# EAGLE design puppetboard (EAGLE 9.6.2)
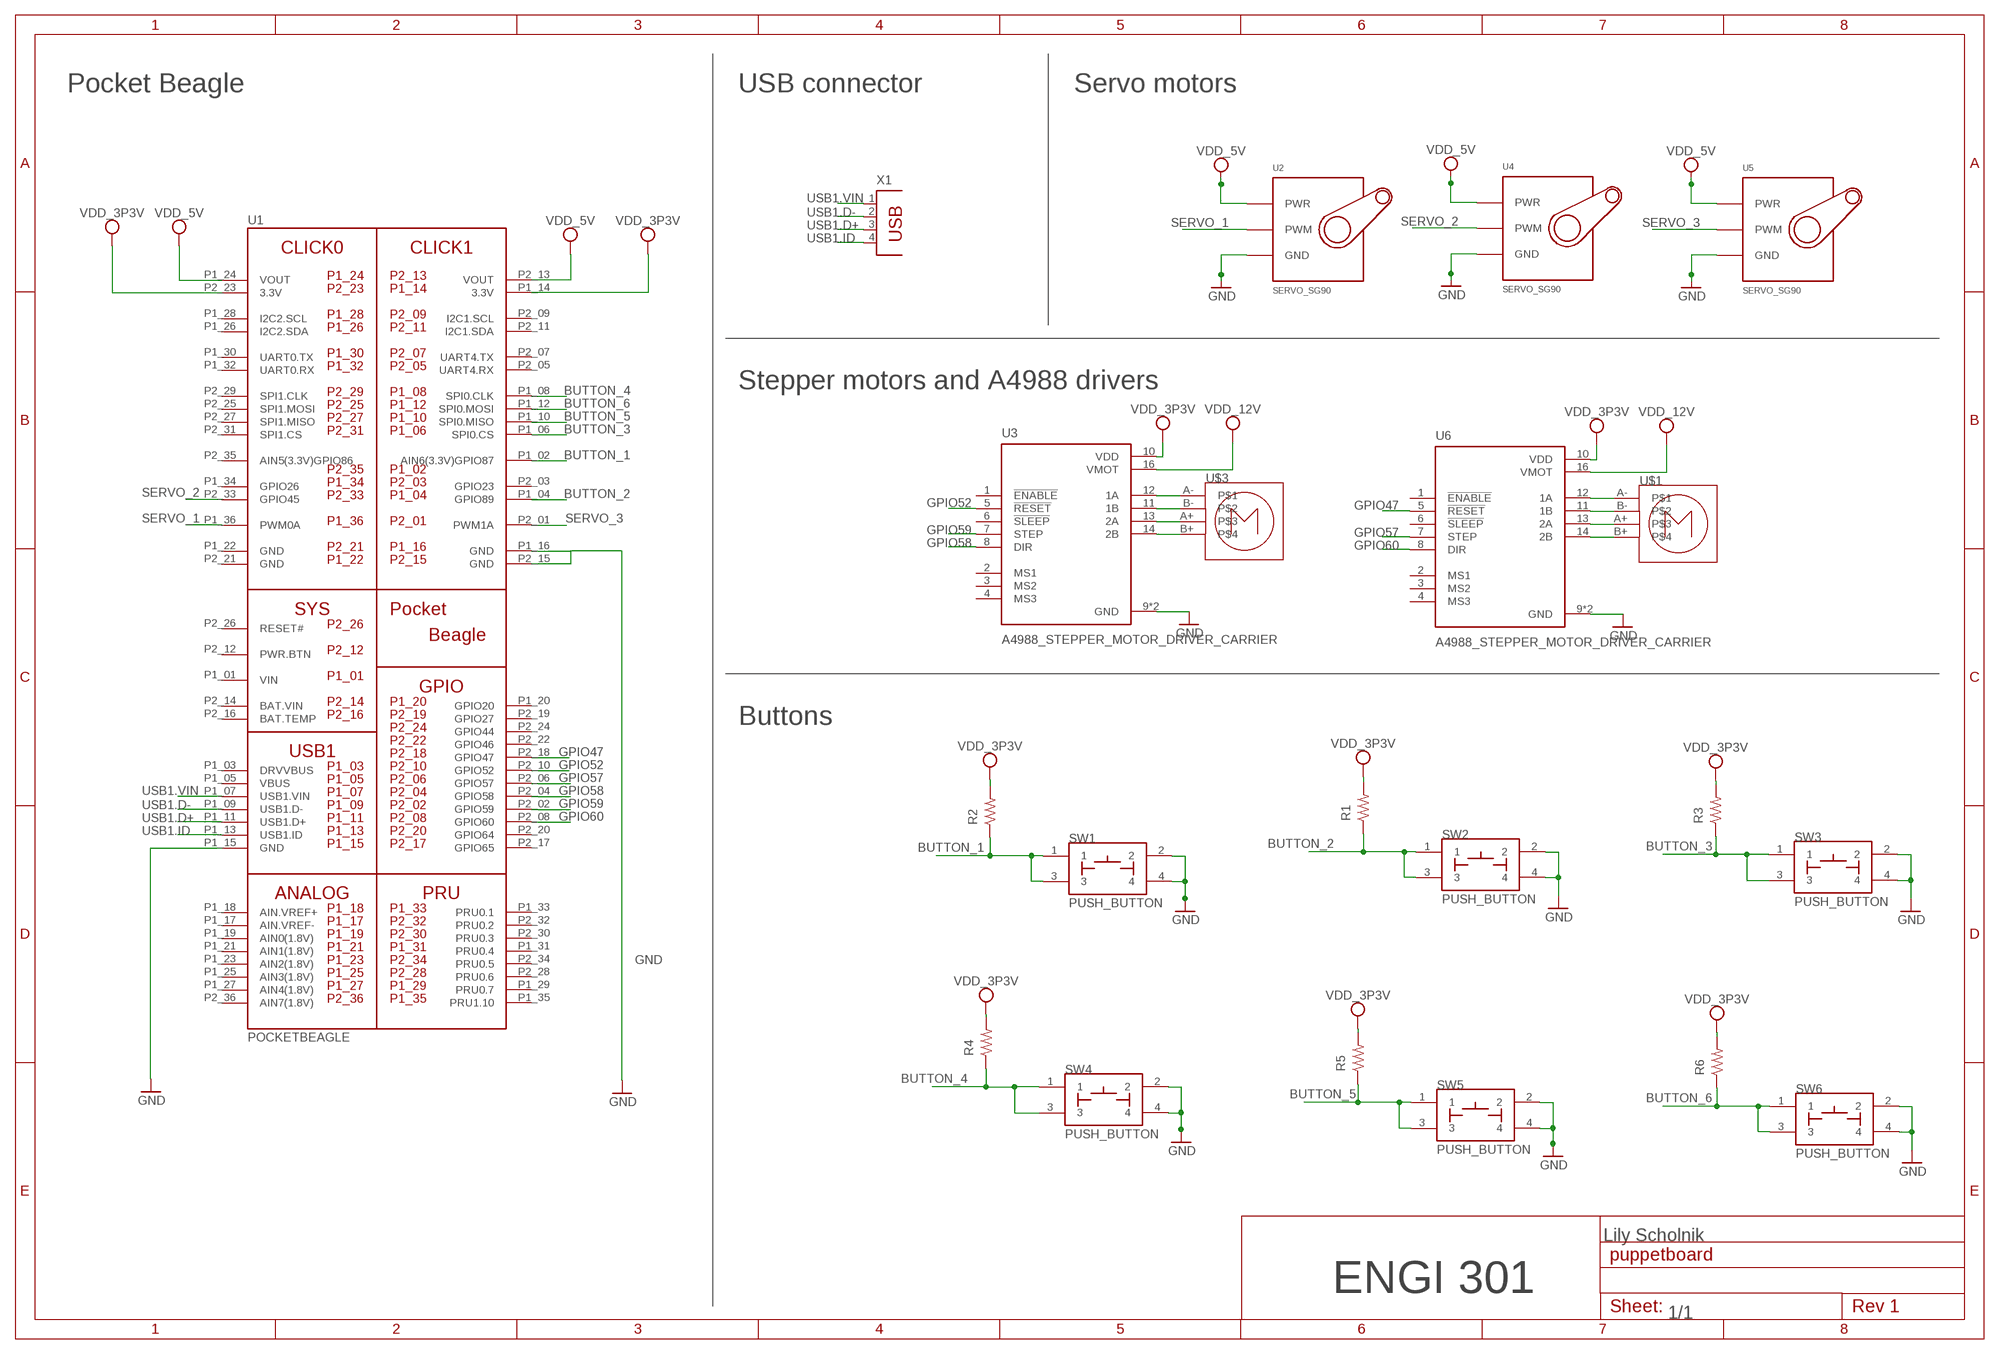
[diagram p0: schematic, sheet 1]

## Parts
R1  R_R0603  [R0603]
R2  R_R0603  [R0603]
R3  R_R0603  [R0603]
R4  R_R0603  [R0603]
R5  R_R0603  [R0603]
R6  R_R0603  [R0603]
SW1  PUSH_BUTTON  [BUTTON_12.5MM]
SW2  PUSH_BUTTON  [BUTTON_12.5MM]
SW3  PUSH_BUTTON  [BUTTON_12.5MM]
SW4  PUSH_BUTTON  [BUTTON_12.5MM]
SW5  PUSH_BUTTON  [BUTTON_12.5MM]
SW6  PUSH_BUTTON  [BUTTON_12.5MM]
U1  POCKETBEAGLE  [POCKETBEAGLE]
U2  SERVO_SG90  [SERVO-X1]
U3  A4988_STEPPER_MOTOR_DRIVER_CARRIER  [MODULE_A4988_STEPPER_MOTOR_DRIVER_CARRIER]
U4  SERVO_SG90  [SERVO-X1]
U5  SERVO_SG90  [SERVO-X1]
U6  A4988_STEPPER_MOTOR_DRIVER_CARRIER  [MODULE_A4988_STEPPER_MOTOR_DRIVER_CARRIER]
U$1  STEPPER_MOTOR  [STEPPER_MOTOR]
U$3  STEPPER_MOTOR  [STEPPER_MOTOR]
X1  PN61729  [PN61729]

## Nets
BUTTON_1: R2.1 SW1.1 SW1.3 U1.P1_02(AIN6(3.3V)GPIO87)
BUTTON_2: R1.1 SW2.1 SW2.3 U1.P1_04(GPIO89)
BUTTON_3: R3.1 SW3.1 SW3.3 U1.P1_06(SPI0.CS)
BUTTON_4: R4.1 SW4.1 SW4.3 U1.P1_08(SPI0.CLK)
BUTTON_5: R5.1 SW5.1 SW5.3 U1.P1_10(SPI0.MISO)
BUTTON_6: R6.1 SW6.1 SW6.3 U1.P1_12(SPI0.MOSI)
GND: SW1.2 SW1.4 SW2.2 SW2.4 SW3.2 SW3.4 SW4.2 SW4.4 SW5.2 SW5.4 SW6.2 SW6.4 U1.P1_15(GND) U1.P1_16(GND) U1.P2_15(GND) U2.GND U3.9(GND) U3.15(GND) U4.GND U5.GND U6.9(GND) U6.15(GND)
GPIO47: U1.P2_18(GPIO47) U6.5(!RESET)
GPIO52: U1.P2_10(GPIO52) U3.5(!RESET)
GPIO57: U1.P2_06(GPIO57) U6.7(STEP)
GPIO58: U1.P2_04(GPIO58) U3.8(DIR)
GPIO59: U1.P2_02(GPIO59) U3.7(STEP)
GPIO60: U1.P2_08(GPIO60) U6.8(DIR)
N$8: U6.12(1A) U$1.A-
N$9: U6.11(1B) U$1.B-
N$10: U6.13(2A) U$1.A+
N$11: U6.14(2B) U$1.B+
N$21: U3.12(1A) U$3.A-
N$22: U3.11(1B) U$3.B-
N$23: U3.13(2A) U$3.A+
N$24: U3.14(2B) U$3.B+
SERVO_1: U1.P1_36(PWM0A) U2.SIG(PWM)
SERVO_2: U1.P2_33(GPIO45) U4.SIG(PWM)
SERVO_3: U1.P2_01(PWM1A) U5.SIG(PWM)
USB1.D+: U1.P1_11(USB1.D+) X1.3
USB1.D-: U1.P1_09(USB1.D-) X1.2
USB1.ID: U1.P1_13(USB1.ID) X1.4
USB1.VIN: U1.P1_07(USB1.VIN) X1.1
VDD_3P3V: R1.2 R2.2 R3.2 R4.2 R5.2 R6.2 U1.P1_14(3.3V) U1.P2_23(3.3V) U3.10(VDD) U6.10(VDD)
VDD_5V: U1.P1_24(VOUT) U1.P2_13(VOUT) U2.PWR U3.16(VMOT) U4.PWR U5.PWR U6.16(VMOT) ; supply symbol labelled VDD_12V
Unconnected: U1.P1_03(DRVVBUS) U1.P1_05(VBUS) U1.P1_17(AIN.VREF-) U1.P1_18(AIN.VREF+) U1.P1_19(AIN0(1.8V)) U1.P1_20(GPIO20) U1.P1_21(AIN1(1.8V)) U1.P1_23(AIN2(1.8V)) U1.P1_25(AIN3(1.8V)) U1.P1_26(I2C2.SDA) U1.P1_27(AIN4(1.8V)) U1.P1_28(I2C2.SCL) U1.P1_29(PRU0.7) U1.P1_30(UART0.TX) U1.P1_31(PRU0.4) U1.P1_32(UART0.RX) U1.P1_33(PRU0.1) U1.P1_34(GPIO26) U1.P1_35(PRU1.10) U1.P2_03(GPIO23) U1.P2_05(UART4.RX) U1.P2_07(UART4.TX) U1.P2_09(I2C1.SCL) U1.P2_11(I2C1.SDA) U1.P2_12(PWR.BTN) U1.P2_16(BAT.TEMP) U1.P2_17(GPIO65) U1.P2_19(GPIO27) U1.P2_20(GPIO64) U1.P2_22(GPIO46) U1.P2_24(GPIO44) U1.P2_25(SPI1.MOSI) U1.P2_26(RESET#) U1.P2_27(SPI1.MISO) U1.P2_28(PRU0.6) U1.P2_29(SPI1.CLK) U1.P2_30(PRU0.3) U1.P2_31(SPI1.CS) U1.P2_32(PRU0.2) U1.P2_34(PRU0.5) U1.P2_35(AIN5(3.3V)GPIO86) U1.P2_36(AIN7(1.8V)) U3.1(!ENABLE) U3.2(MS1) U3.3(MS2) U3.4(MS3) U3.6(!SLEEP) U6.1(!ENABLE) U6.2(MS1) U6.3(MS2) U6.4(MS3) U6.6(!SLEEP)

## Notes on the sheet
- Pocket Beagle | USB connector | Servo motors
- Stepper motors and A4988 drivers
- Buttons
- Lily Scholnik
- ENGI 301
- 1/1

## Power pins joined to a net without a drawn wire
BAT.VIN: U1.P2_14(BAT.VIN)
GND: U1.P1_22(GND) U1.P2_21(GND)
VIN: U1.P1_01(VIN)

## Library data of the parts
R1-R6 = combolock:R_: RESISTOR, American symbol
SW1-SW6 = combolock:PUSH_BUTTON
U1 = combolock:POCKETBEAGLE
U2 U4 U5 = combolock:SERVO_SG90
U3 U6 = A4988_STEPPER_MOTOR_DRIVER_CARRIER:A4988_STEPPER_MOTOR_DRIVER_CARRIER: Stepper motor controler; IC: A4988; 1A; Uin mot: 8÷35V Check availability <https://pricing.snapeda.com/parts/A4988%20STEPPER%20MOTOR%20DRIVER%20CARRIER/Pololu/view-part?ref=eda>; AVAILABILITY: Not in stock; DESCRIPTION: Stepper Motor Driver; MF: Pololu; MP: A4988 STEPPER MOTOR DRIVER CARRIER; PACKAGE: None; PRICE: None
U$1 U$3 = shadowpuppets:STEPPER_MOTOR
X1 = con-berg:PN61729: BERG USB connector; OC_FARNELL: unknown; OC_NEWARK: unknown

## Board
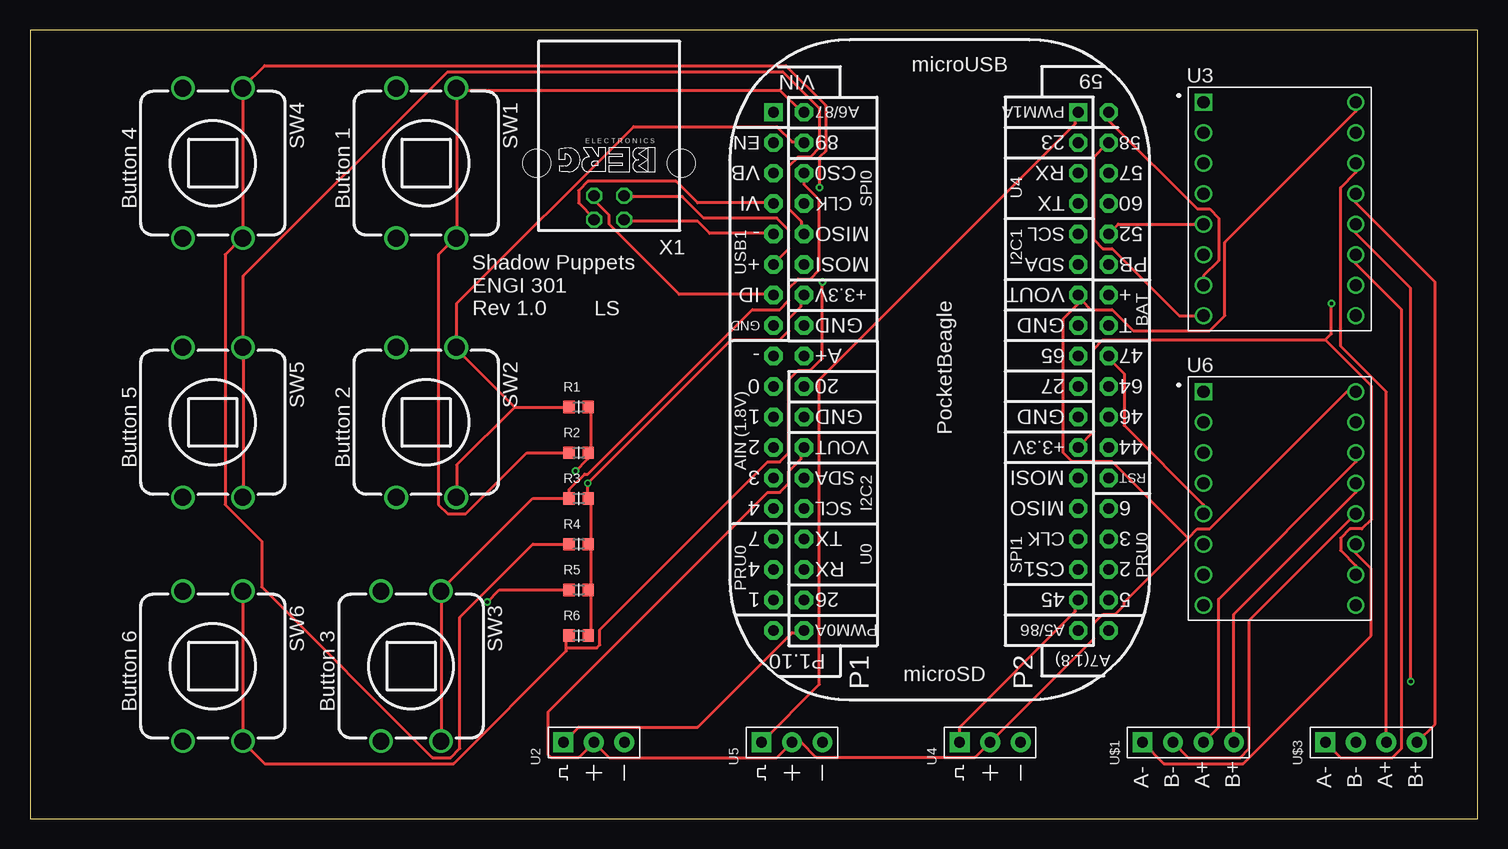
[diagram p1: board, top side]
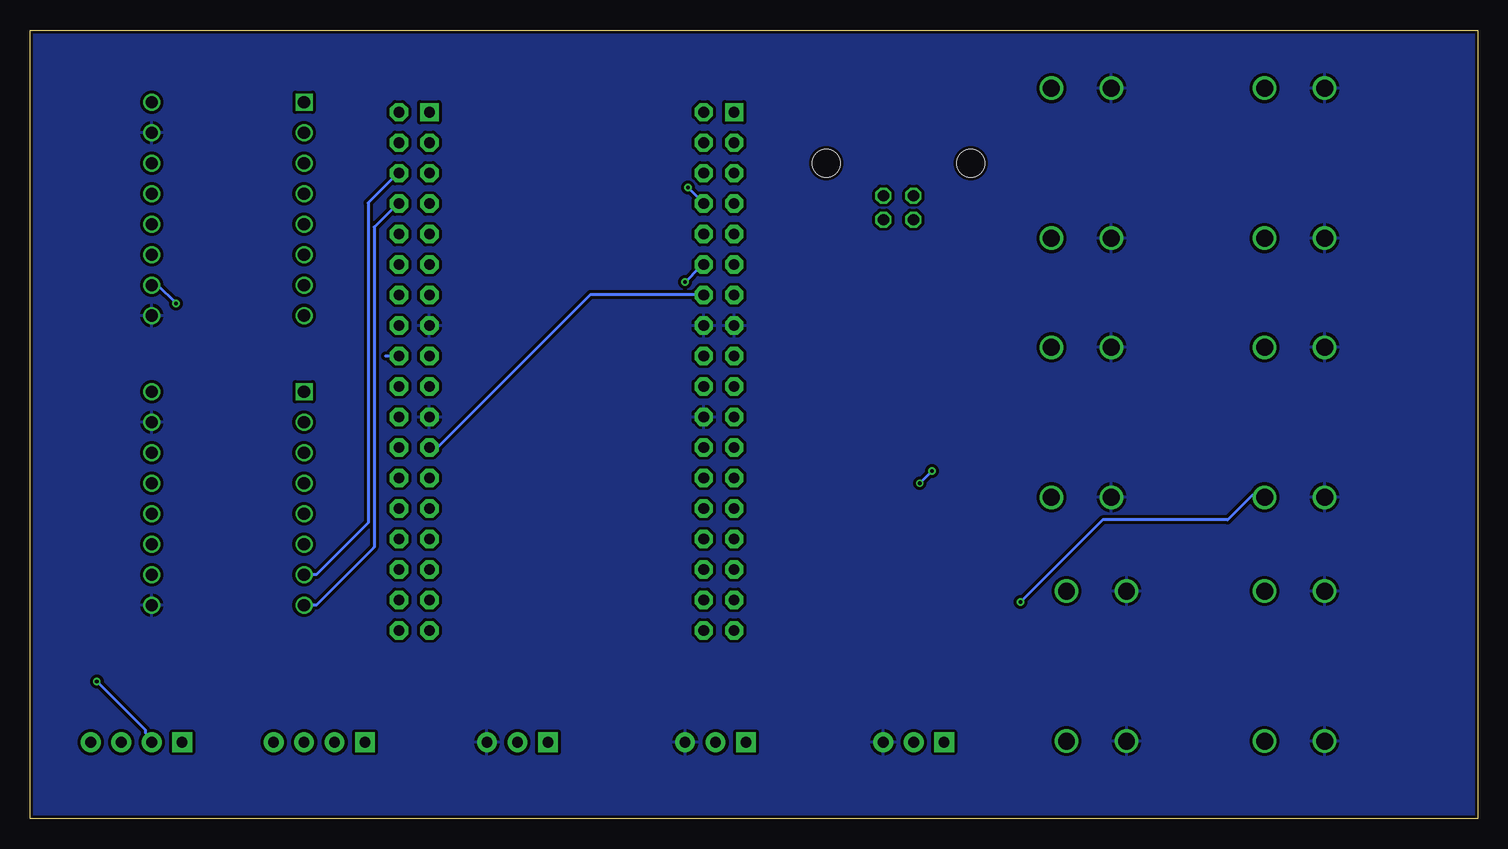
[diagram p2: board, bottom side, seen from below]

Size 120.63 x 65.71 mm. Coordinates in mm from the lower left corner, seen from the top.
Outline: 0,0 120.63,0 120.63,65.71 0,65.71 0,0
Copper layers (1*2*15*16): Top 0.035mm / dielectric 0.23mm / Route2 0.035mm / dielectric 0.93mm / Route15 0.035mm / dielectric 0.23mm / Bottom 0.035mm
Design rules "ENGI301_4lyr": minimum track width 10mil, minimum drill 12mil, track to track 10mil, track to pad 10mil, pad to pad 10mil, via to via 10mil, smd to smd 10mil, copper to edge 10mil, drill to drill 12mil, minimum pad ring 6mil, minimum via ring 6mil, stop-mask expansion 3mil, vias tented up to drill 25mil, thermal gap 10mil

### Footprints (pad centres in the part's own frame; a part is rotated, then mirrored left to right if it is on the bottom)
R0603 = smd 0.95 x 1.031: 1 -0.8,0; 2 0.8,0
BUTTON_12.5MM = drill 1.4: 1 -6.25,2.5; 2 -6.25,-2.5; 3 6.25,2.5; 4 6.25,-2.5
POCKETBEAGLE = drill 0.889 pad 1.524 square: P1_01 5.91,3.53; P2_01 5.91,28.93 | drill 0.889 pad 1.524 octagon: P1_02 5.91,6.07; P1_03 8.45,3.53; P1_04 8.45,6.07; P1_05 10.99,3.53; P1_06 10.99,6.07; P1_07 13.53,3.53; P1_08 13.53,6.07; P1_09 16.07,3.53; P1_10 16.07,6.07; P1_11 18.61,3.53; P1_12 18.61,6.07; P1_13 21.15,3.53; P1_14 21.15,6.07; P1_15 23.69,3.53; P1_16 23.69,6.07; P1_17 26.23,3.53; P1_18 26.23,6.07; P1_19 28.77,3.53; P1_20 28.77,6.07; P1_21 31.31,3.53; P1_22 31.31,6.07; P1_23 33.85,3.53; P1_24 33.85,6.07; P1_25 36.39,3.53; P1_26 36.39,6.07; P1_27 38.93,3.53; P1_28 38.93,6.07; P1_29 41.47,3.53; P1_30 41.47,6.07; P1_31 44.01,3.53; P1_32 44.01,6.07; P1_33 46.55,3.53; P1_34 46.55,6.07; P1_35 49.09,3.53; P1_36 49.09,6.07; P2_02 5.91,31.47; P2_03 8.45,28.93; P2_04 8.45,31.47; P2_05 10.99,28.93; P2_06 10.99,31.47; P2_07 13.53,28.93; P2_08 13.53,31.47; P2_09 16.07,28.93; P2_10 16.07,31.47; P2_11 18.61,28.93; P2_12 18.61,31.47; P2_13 21.15,28.93; P2_14 21.15,31.47; P2_15 23.69,28.93; P2_16 23.69,31.47; P2_17 26.23,28.93; P2_18 26.23,31.47; P2_19 28.77,28.93; P2_20 28.77,31.47; P2_21 31.31,28.93; P2_22 31.31,31.47; P2_23 33.85,28.93; P2_24 33.85,31.47; P2_25 36.39,28.93; P2_26 36.39,31.47; P2_27 38.93,28.93; P2_28 38.93,31.47; P2_29 41.47,28.93; P2_30 41.47,31.47; P2_31 44.01,28.93; P2_32 44.01,31.47; P2_33 46.55,28.93; P2_34 46.55,31.47; P2_35 49.09,28.93; P2_36 49.09,31.47
SERVO-X1 = drill 0.889 pad 1.651: GND 0,-2.54; PWR 0,0 | drill 0.889 pad 1.651 square: SIG 0,2.54
MODULE_A4988_STEPPER_MOTOR_DRIVER_CARRIER = drill 1.02 square: 1 -6.35,8.89 | drill 1.02: 2 -6.35,6.35; 3 -6.35,3.81; 4 -6.35,1.27; 5 -6.35,-1.27; 6 -6.35,-3.81; 7 -6.35,-6.35; 8 -6.35,-8.89; 9 6.35,-8.89; 10 6.35,-6.35; 11 6.35,-3.81; 12 6.35,-1.27; 13 6.35,1.27; 14 6.35,3.81; 15 6.35,6.35; 16 6.35,8.89
STEPPER_MOTOR = drill 0.889 pad 1.651: A+ 2.54,-1.27; A- 2.54,3.81; B+ 2.54,1.27 | drill 0.889 pad 1.651 square: B- 2.54,6.35
PN61729 = drill 0.95 octagon: 1 1.25,4.71; 2 -1.25,4.71; 3 -1.25,2.71; 4 1.25,2.71 | hole 2.3: -6.02,0; 6.02,0

### Placement (x,y rotation side)
R1  45.72,34.29 0 top
R2  45.72,30.48 0 top
R3  45.72,26.67 0 top
R4  45.72,22.86 0 top
R5  45.72,19.05 0 top
R6  45.72,15.24 0 top
SW1  33.02,54.61 270 top
SW2  33.02,33.02 270 top
SW3  31.75,12.7 270 top
SW4  15.24,54.61 270 top
SW5  15.24,33.02 270 top
SW6  15.24,12.7 270 top
U1  58.42,64.77 270 top
U2  46.99,6.35 90 top
U3  104.14,50.8 0 top
U4  80.01,6.35 90 top
U5  63.5,6.35 90 top
U6  104.14,26.67 0 top
U$1  99.06,3.81 90 top
U$3  114.3,3.81 90 top
X1  48.26,54.61 180 top

### Tracks (layer width: path | path; a pad name or v marks a point on that pad's centre or on a via)
BUTTON_1
  Top 0.254: R2.1 41.4,30.48 36.32,25.4 34.8,25.4 34.04,26.16 34.04,46.99 35.31,48.26 SW1.3 35.56,48.51 35.56,60.71 | 35.56,60.71 62.48,60.71 64.26,58.93 U1.P1_02 | 35.56,60.71 SW1.1
BUTTON_2
  Top 0.254: SW2.1 35.52,39.58 | 40.39,34.29 R1.1 | 40.39,34.29 35.56,39.12 SW2.1 | U1.P1_04 64.26,56.39 63.5,56.39 62.23,57.66 50.29,57.66 35.56,42.93 35.56,39.62 SW2.1 | 40.39,34.29 35.56,29.46 35.56,26.92 SW2.3
BUTTON_3
  Top 0.254: U1.P1_06 64.52,53.59 64.52,52.83 65.79,51.56 65.79,45.72 65.02,44.96 64.01,44.96 63.25,44.2 63.25,43.18 62.48,42.42 60.2,42.42 46.48,28.7 46.23,28.7 44.96,27.43 44.96,26.67 R3.1 41.91,26.67 34.29,19.05 SW3.1 34.29,18.8 34.29,6.6 SW3.3
BUTTON_4  (via drill 0.3)
  Top 0.254: v65.79,52.58 65.79,55.12 66.29,55.63 66.29,59.44 62.99,62.74 19.56,62.74 17.78,60.96 SW4.1 17.78,60.71 17.78,48.51 SW4.3 17.53,48.26 16.26,46.99 16.26,26.16 19.3,23.11 19.3,19.3 33.53,5.08 35.05,5.08 35.81,5.84 35.81,16.76 41.91,22.86 R4.1
  Bottom 0.254: v65.79,52.58 64.52,51.31 U1.P1_08
BUTTON_5  (via drill 0.3)
  Top 0.254: R5.1 39.12,19.05 v38.1,18.03 | U1.P1_10 64.26,48.77 64.26,49.78 63.25,50.8 63.25,54.36 64.01,55.12 65.02,55.12 65.79,55.88 65.79,59.18 62.74,62.23 34.8,62.23 17.78,45.21 17.78,39.37 SW5.1 17.78,39.12 17.78,26.92 SW5.3
  Bottom 0.254: v38.1,18.03 31.24,24.89 20.83,24.89 18.8,26.92 17.78,26.92 SW5.3
BUTTON_6  (via drill 0.3)
  Top 0.254: 44.7,14.22 44.7,13.97 35.31,4.57 19.56,4.57 17.78,6.35 SW6.3 17.78,6.6 17.78,18.8 SW6.1 | 44.7,14.22 44.7,15.24 R6.1 | v66.04,44.7 66.04,38.35 65.02,37.34 64.01,37.34 63.25,36.58 63.25,30.48 62.48,29.72 61.47,29.72 47.5,15.75 47.5,14.48 47.24,14.22 44.7,14.22
  Bottom 0.254: v66.04,44.7 64.77,45.97 64.52,45.97 U1.P1_12
GND
  Top 0.254: U6.9 111.03,17.78
  pour Bottom: 0,66.04 120.65,66.04 120.65,0 0,0
GPIO47
  Top 0.254: U6.5 97.79,26.16 91.19,32.77 91.19,37.08 89.92,38.35 U1.P2_18
  Bottom 0.254: U1.P2_18 91,38.54
GPIO52
  Top 0.254: U3.5 90.68,49.53 89.92,48.77 U1.P2_10
GPIO57
  Bottom 0.254: U6.7 96.77,20.32 92.46,24.64 92.46,51.31 89.92,53.85 U1.P2_06
GPIO58
  Top 0.254: U3.8 95.76,41.91 90.17,47.5 89.41,47.5 88.65,48.26 88.65,55.12 89.66,56.13 U1.P2_04
GPIO59
  Top 0.254: U3.7 97.79,45.21 99.06,46.48 99.06,50.04 98.3,50.8 97.28,50.8 89.92,58.17 89.92,58.67 U1.P2_02
GPIO60
  Bottom 0.254: U6.8 96.77,17.78 91.95,22.61 91.95,49.28 89.92,51.31 U1.P2_08
N$8
  Top 0.254: U6.12 101.6,16.51 101.6,5.84 100.84,5.08 96.52,5.08 U$1.A-
N$9
  Top 0.254: U6.11 110.49,22.1 111.76,20.83 111.76,15.24 101.09,4.57 94.49,4.57 U$1.B-
N$10
  Top 0.254: U6.13 110.49,27.18 100.33,17.02 U$1.A+
N$11
  Top 0.254: U6.14 110.49,29.72 99.06,18.29 99.06,7.62 U$1.B+
N$21  (via drill 0.3)
  Top 0.254: U3.12 110.49,48.77 115.06,44.2 v115.06,11.43
  Bottom 0.254: v115.06,11.43 111,7.37 111,7.11 110.49,6.6 U$3.A-
N$22
  Top 0.254: U3.11 110.49,46.23 114.3,42.42 114.3,5.84 113.54,5.08 109.22,5.08 U$3.B-
N$23
  Top 0.254: U3.13 110.49,51.31 117.09,44.7 117.09,7.87 U$3.A+
N$24
  Top 0.254: U3.14 110.49,53.85 109.22,52.58 109.22,39.37 113.03,35.56 U$3.B+
SERVO_1
  Top 0.254: U2.SIG 45.72,7.62 55.63,7.62 63.5,15.49 64.26,15.49 U1.P1_36
SERVO_2
  Top 0.254: U4.SIG 77.47,7.62 87.12,17.27 87.12,18.03 U1.P2_33
SERVO_3
  Top 0.254: U5.SIG 65.79,11.18 65.79,36.58 87.12,57.91 87.12,58.67 U1.P2_01
USB1.D+
  Top 0.254: X1.3 49.53,51.82 54.36,51.82 56.13,50.04 62.23,50.04 63.25,49.02 63.25,47.5 61.98,46.23 U1.P1_11
USB1.D-
  Top 0.254: X1.2 49.53,49.78 55.63,49.78 56.64,48.77 61.72,48.77 U1.P1_09
USB1.ID
  Top 0.254: X1.4 47.24,51.82 47.24,51.31 48.26,50.29 48.26,49.53 54.1,43.69 61.72,43.69 U1.P1_13
USB1.VIN
  Top 0.254: X1.1 46.99,50.04 45.72,51.31 45.72,52.32 46.48,53.09 53.85,53.09 55.63,51.31 61.72,51.31 U1.P1_07
VDD_3P3V  (via drill 0.3)
  Top 0.254: R1.2 46.74,34.29 46.74,30.48 R2.2 46.48,30.48 46.48,29.97 v45.47,28.96 | 46.74,19.05 46.74,15.24 R6.2 | 46.74,22.86 46.74,26.67 R3.2 46.48,26.67 v46.48,27.94 58.42,39.88 62.48,39.88 63.25,40.64 63.25,41.66 64.26,42.67 64.26,43.43 U1.P1_14 | 46.74,22.86 46.74,19.05 | 46.74,19.05 R5.2 | 46.74,22.86 R4.2 | U6.10 110.49,21.08 109.22,22.35 109.22,23.37 109.98,24.13 111,24.13 111.76,24.89 111.76,36.07 107.95,39.88 | 107.95,39.88 89.41,39.88 88.65,39.12 88.65,32.26 87.38,30.99 U1.P2_23 | v108.46,42.93 108.46,40.39 107.95,39.88
  Bottom 0.254: v46.48,27.94 v45.47,28.96 | U3.10 109.98,44.45 v108.46,42.93 | U1.P1_14 64.52,43.69 73.91,43.69 86.61,30.99 87.12,30.99 U1.P2_23
VDD_5V
  Top 0.254: U1.P1_24 64.26,30.73 64.26,29.97 63.25,28.96 63.25,27.94 62.48,27.18 61.47,27.18 43.18,8.89 43.18,5.33 43.43,5.08 45.72,5.08 U2.PWR 48.26,5.08 62.23,5.08 U5.PWR 64.26,6.35 65.53,5.08 78.74,5.08 U4.PWR 88.65,14.99 88.65,16.26 89.41,17.02 90.42,17.02 91.19,17.78 91.19,18.03 96.52,23.37 | U3.16 110.49,58.93 99.57,48.01 99.57,41.91 98.3,40.64 91.95,40.64 90.17,42.42 88.39,42.42 87.63,43.18 | 87.63,43.18 87.38,43.43 U1.P2_13 87.63,43.18 | U6.16 109.73,35.56 98.3,24.13 97.28,24.13 96.52,23.37 | 87.63,43.18 86.11,41.66 86.11,30.48 86.87,29.72 90.17,29.72 96.52,23.37

### Text on the board
tPlace: Button 4 | Button 1 | Shadow Puppets / ENGI 301 / Rev 1.0 | LS | Button 5 | Button 2 | Button 6 | Button 3